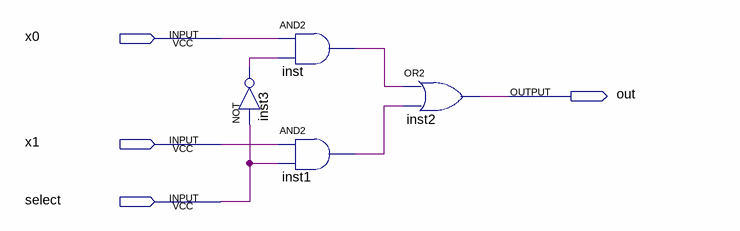
[diagram p0: schematic sheet]
// Quartus schematic 2to1mux.bdf as structural Verilog: 4 symbols, 4 pins
module \2to1mux  (
  input  x0,
  input  x1,
  input  select,
  output out
);

  wire inst1_out, inst3_out, inst_out;

  and inst (inst_out, x0, inst3_out);
  not inst3 (inst3_out, select);
  and inst1 (inst1_out, x1, select);
  or inst2 (out, inst_out, inst1_out);
endmodule
